# EasyEDA schematic SCH_TouchScreenMotorController_2025-12-24.json
TITLE: Watch Cleaner Controller; REV: 1.0; Date: 2025-12-15; Sheet: 1/1; Drawn By: John; Company: John Russo
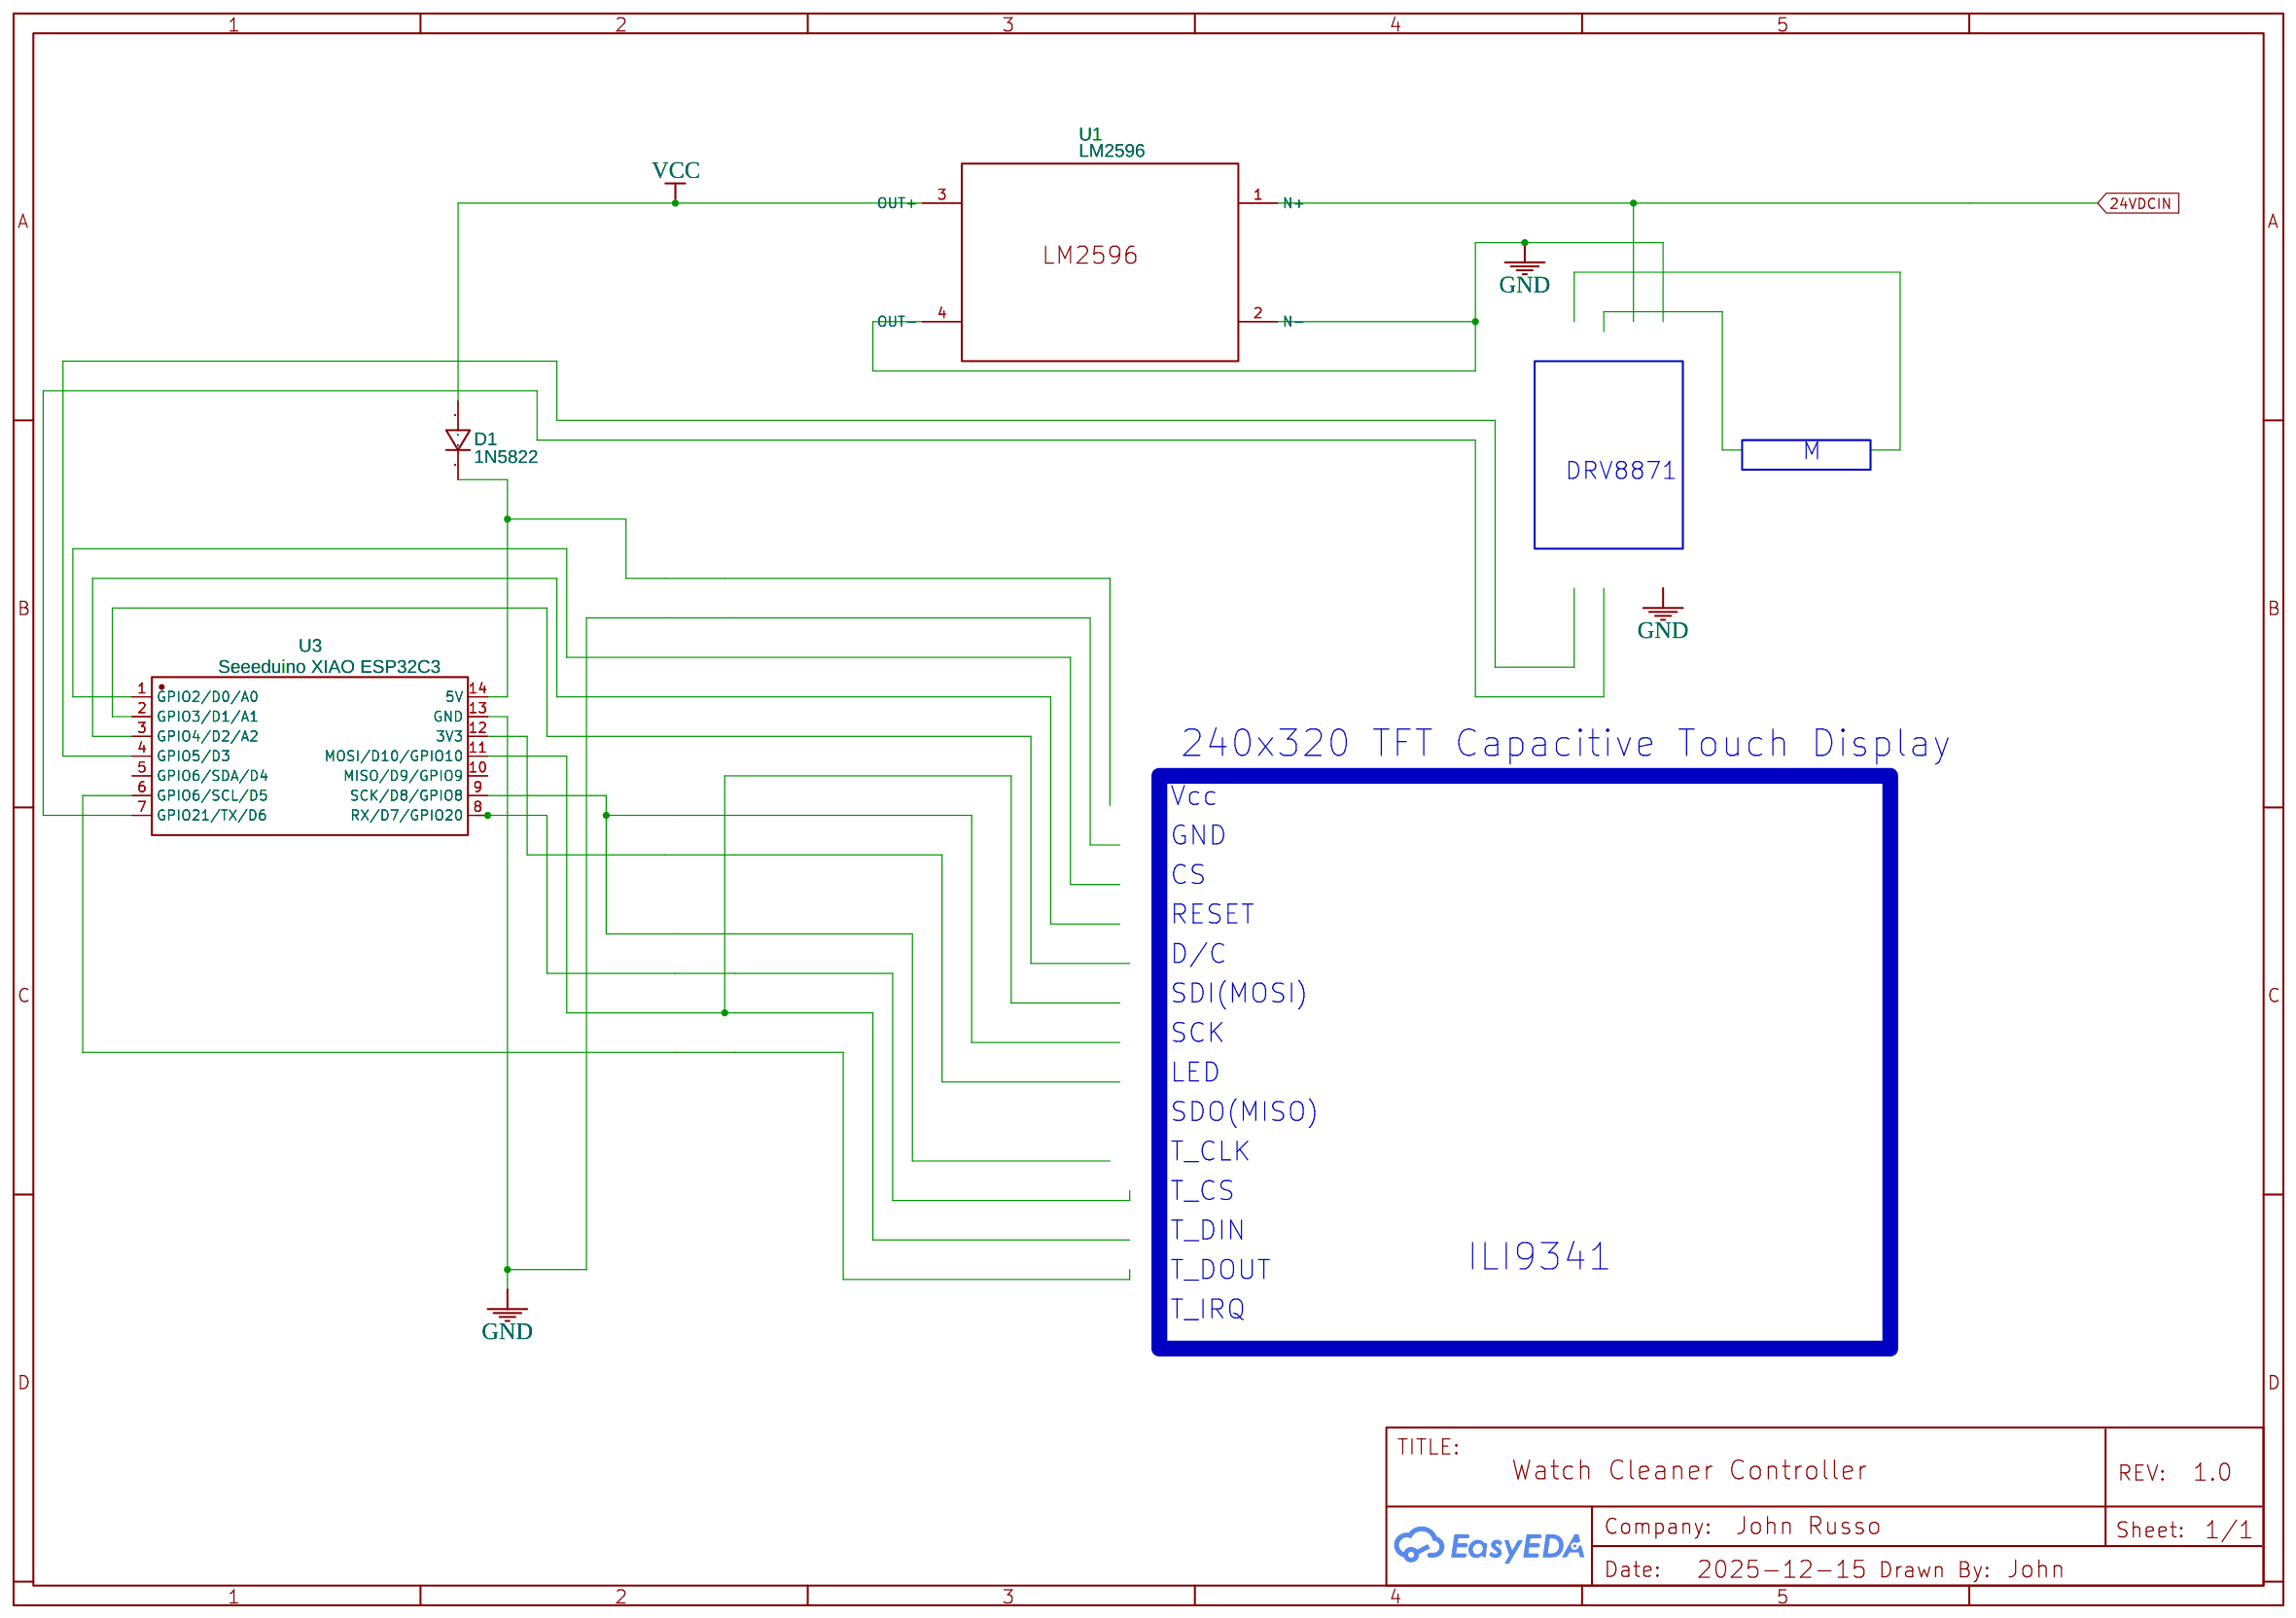
[diagram p0: schematic sheet]

## Parts
D1  1N5822  [SOD-123_L2.8-W1.8-LS3.7-RD]
U1  LM2596
U3  Seeeduino XIAO ESP32C3  [MODULE XAIO 14P-2.54-21X17.8MM]

## Library data of the parts
D1 = 1N4007W: Supplier: LCSC; Supplier Part: C328592; Manufacturer: BLUE ROCKET; Contributor: LCEDA_Lib
U1 = LM2596: Contributor: rtcw50
U3 = Seeeduino XIAO: link: http://wiki.seeedstudio.com/Seeeduino-XIAO/; Contributor: paul_1809

## Nets
GND: U3.13(GND)
VCC: D1.2
Net-(D1-1): D1.1 U3.14(5V)

Not connected (* = marked no-connect by the designer): U1 1(N+) 2(N-) 3(OUT+) 4(OUT-); U3 1(GPIO2/D0/A0) 2(GPIO3/D1/A1) 3(GPIO4/D2/A2) 4(GPIO5/D3) 5(GPIO6/SDA/D4) 6(GPIO6/SCL/D5) 7(GPIO21/TX/D6) 8(RX/D7/GPIO20) 9(SCK/D8/GPIO8) 10(MISO/D9/GPIO9) 11(MOSI/D10/GPIO10) 12(3V3)

## Notes on the sheet
- M
- DRV8871
- 240x320 TFT Capacitive Touch Display
- Vcc
- GND
- CS
- RESET
- D/C
- SDI(MOSI)
- SCK
- LED
- SDO(MISO)
- T_CLK
- T_CS
- T_DIN
- T_DOUT
- ILI9341
- T_IRQ
